# Altium schematic sheet Infrared.SchDoc
size A2
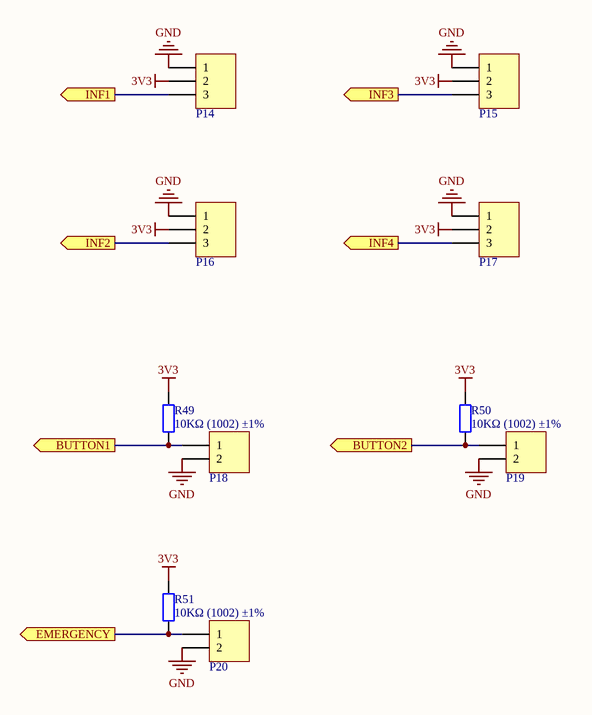
[diagram p0: Infrared.SchDoc]

## Parts
P14  B3B-PH-SM4-TB(LF)(SN)  [B3B-PH-SM4-TB(LF)(SN)]  (value not drawn)
P15  B3B-PH-SM4-TB(LF)(SN)  [B3B-PH-SM4-TB(LF)(SN)]  (value not drawn)
P16  B3B-PH-SM4-TB(LF)(SN)  [B3B-PH-SM4-TB(LF)(SN)]  (value not drawn)
P17  B3B-PH-SM4-TB(LF)(SN)  [B3B-PH-SM4-TB(LF)(SN)]  (value not drawn)
P18  B2B-PH-SM4-TB(LF)(SN)  [B2B-PH-SM4-TB(LF)(SN)]  (value not drawn)
P19  B2B-PH-SM4-TB(LF)(SN)  [B2B-PH-SM4-TB(LF)(SN)]  (value not drawn)
P20  B2B-PH-SM4-TB(LF)(SN)  [B2B-PH-SM4-TB(LF)(SN)]  (value not drawn)
R49  10KΩ (1002) ±1%  [0603_R]
R50  10KΩ (1002) ±1%  [0603_R]
R51  10KΩ (1002) ±1%  [0603_R]

## Ports
BUTTON1 (out), BUTTON2 (out), EMERGENCY (out), INF1 (out), INF2 (out), INF3 (out), INF4 (out)

## Nets
3V3: P14.2 P15.2 P16.2 P17.2 R49.2 R50.2 R51.2
GND: P14.1 P15.1 P16.1 P17.1 P18.2 P19.2 P20.2
BUTTON1: P18.1 R49.1 ; port BUTTON1
BUTTON2: P19.1 R50.1 ; port BUTTON2
EMERGENCY: P20.1 R51.1 ; port EMERGENCY
INF1: P14.3 ; port INF1
INF2: P16.3 ; port INF2
INF3: P15.3 ; port INF3
INF4: P17.3 ; port INF4

## Library data of the parts
P14-P17 = CONN HEADER PH TOP 3POS 2MM SMD: Manufacturer: JST Sales America Inc.; Unit Price in Quantity: .2972; Part Number: CONN HEADER PH TOP 3POS 2MM SMD; Mounting Type: SMD; Package: header; Component Type: Standard; Pin Count: 3; Manufacturer Part Number: B3B-PH-SM4-TB(LF)(SN); Supplier 1: Digikey; Supplier 1 Part Number: 455-1735-1-ND; Unit Price-Supplier 1: .63; Price Break: 1000; Vendor/Distributor: Digikey
P18-P20 = CONN HEADER PH TOP 2POS 2MM SMD: Manufacturer: JST Sales America Inc.; Unit Price in Quantity: .3467; Part Number: CONN HEADER PH TOP 2POS 2MM SMD; Mounting Type: SMD; Package: header; Component Type: Standard; Pin Count: 2; Manufacturer Part Number: B2B-PH-SM4-TB(LF)(SN); Supplier 1: Digikey; Supplier 1 Part Number: 455-1734-1-ND; Unit Price-Supplier 1: .55; Price Break: 500; Vendor/Distributor: Digikey
R49-R51 = 0603 10KΩ (1002) 1%: 贴片电阻; ComponentLink1Description: 供应商链接; ComponentLink1URL: http://www.szlcsc.com/product/details_26547.html; Package: 0603; Supplier: LC; SuppliersPartNumber: C25804